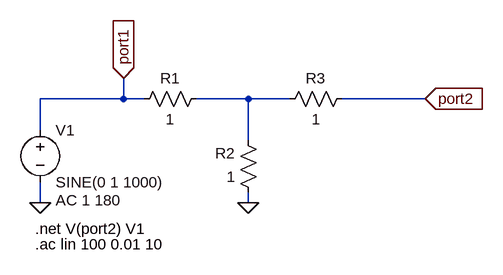
[diagram p0: schematic CircTarea5.asc]
CircTarea5.asc, the LTspice schematic file:
Version 4.1
SHEET 1 880 680
WIRE 48 96 48 64
WIRE 48 96 -80 96
WIRE 80 96 48 96
WIRE 240 96 160 96
WIRE 304 96 240 96
WIRE 512 96 384 96
WIRE -80 144 -80 96
WIRE 240 160 240 96
WIRE -80 256 -80 224
WIRE 240 256 240 240
FLAG 240 256 0
FLAG -80 256 0
FLAG 48 64 port1
IOPIN 48 64 In
FLAG 512 96 port2
IOPIN 512 96 In
SYMBOL voltage -80 128 R0
WINDOW 123 24 124 Left 2
WINDOW 39 0 0 Left 0
SYMATTR InstName V1
SYMATTR Value SINE(0 1 1000)
SYMATTR Value2 AC 1 180
SYMBOL res 176 80 R90
WINDOW 0 0 56 VBottom 2
WINDOW 3 32 56 VTop 2
SYMATTR InstName R1
SYMATTR Value 1
SYMBOL res 256 256 R180
WINDOW 0 36 76 Left 2
WINDOW 3 36 40 Left 2
SYMATTR InstName R2
SYMATTR Value 1
SYMBOL res 288 112 R270
WINDOW 0 32 56 VTop 2
WINDOW 3 0 56 VBottom 2
SYMATTR InstName R3
SYMATTR Value 1
TEXT -88 296 Left 2 !.net V(port2) V1
TEXT -88 320 Left 2 !.ac lin 100 0.01 10

The netlist it stands for:
* CircTarea5.asc
V1 port1 0 SINE(0 1 1000) AC 1 180
R1 N001 port1 1
R2 0 N001 1
R3 N001 port2 1
.net V(port2) V1
.ac lin 100 0.01 10
.backanno
.end